# EAGLE design kegtroller_v1 (EAGLE 6.1)
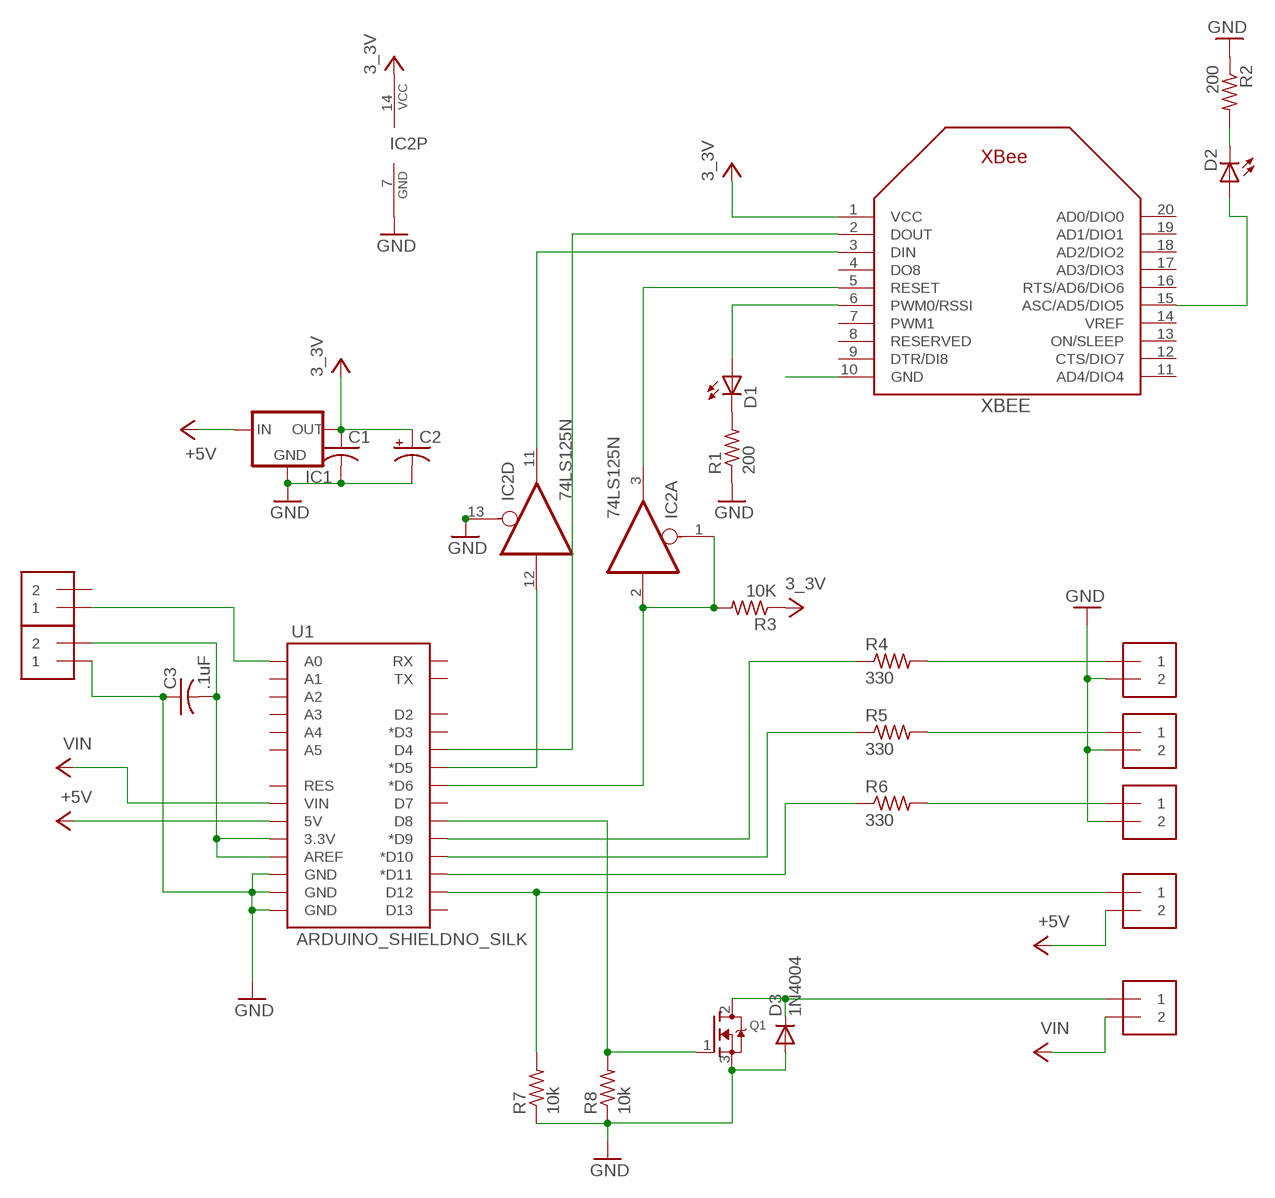
[diagram p0: schematic, sheet 1]

## Parts
C1  C-US025-025X050  [C025-025X050]
C2  CPOL-USE2.5-5  [E2,5-5]
C3  .1uF  C-US025-025X050  [C025-025X050]
D1  LED3MM  [LED3MM]
D2  LED3MM  [LED3MM]
D3  1N4004  [DO41-10]
IC1  MC1700  [TO92]
IC2  74LS125N  [DIL14]
J1  1X2-3.5MM  [1X2-3.5MM]
J2  1X2-3.5MM  [1X2-3.5MM]
J3  1X2-3.5MM  [1X2-3.5MM]
J4  1X2-3.5MM  [1X2-3.5MM]
J5  1X2-3.5MM  [1X2-3.5MM]
J6  1X2-3.5MM  [1X2-3.5MM]
J7  1X2-3.5MM  [1X2-3.5MM]
Q1  MOSFET-NGDS_TO220V  [TO220V]
R1  200  R-US_0207/10  [0207/10]
R2  200  R-US_0207/10  [0207/10]
R3  10K  R-US_0207/10  [0207/10]
R4  330  R-US_0204/5  [0204/5]
R5  330  R-US_0204/5  [0204/5]
R6  330  R-US_0204/5  [0204/5]
R7  10k  R-US_0204/5  [0204/5]
R8  10k  R-US_0204/5  [0204/5]
U1  ARDUINO_SHIELDNO_SILK  [DUEMILANOVE_VIAS]
XBEE  XBEE  [XBEE]

## Nets
3_3V: C1.1 C2.+ IC1.3(OUT) IC2.14(P:VCC) R3.1 XBEE.1(VCC)
+5V: IC1.2(IN) J4.2 U1.5V
GND: C1.2 C2.- C3.1 D3.A IC1.1(GND) IC2.7(P:GND) IC2.13(D:OE) J1.2 J2.2 J3.2 J6.1 Q1.3(S) R1.1 R2.1 R7.1 R8.1 U1.GND@0(GND) U1.GND@1(GND) U1.GND@2(GND) XBEE.10(GND)
N$1: IC2.12(D:I) U1.D5(*D5)
N$2: IC2.11(D:O) XBEE.3(DIN)
N$5: D2.K(C) R2.2
N$7: D1.A XBEE.6(PWM0/RSSI)
N$8: D1.K(C) R1.2
N$9: D2.A XBEE.15(ASC/AD5/DIO5)
N$13: IC2.3(A:O) XBEE.5(RESET)
N$22: R4.1 U1.D9(*D9)
N$23: R5.1 U1.D10(*D10)
N$24: R6.1 U1.D11(*D11)
N$25: J1.1 R4.2
N$26: J2.1 R5.2
N$27: J3.1 R6.2
N$29: C3.2 J6.2 U1.3.3V U1.AREF
N$30: J5.1 U1.A0
N$31: J4.1 R7.2 U1.D12
N$34: D3.C J7.1 Q1.2(D)
N$35: Q1.1(G) R8.2 U1.D8
RESET: IC2.1(A:OE) IC2.2(A:I) R3.2 U1.D6(*D6)
TX: U1.D4 XBEE.2(DOUT)
VIN: J7.2 U1.VIN
Unconnected: IC2.4(B:OE) IC2.5(B:I) IC2.6(B:O) IC2.8(C:O) IC2.9(C:I) IC2.10(C:OE) J5.2 U1.A1 U1.A2 U1.A3 U1.A4 U1.A5 U1.D2 U1.D3(*D3) U1.D7 U1.D13 U1.RES U1.RX U1.TX XBEE.4(DO8) XBEE.7(PWM1) XBEE.8(RESERVED) XBEE.9(DTR/DI8) XBEE.11(AD4/DIO4) XBEE.12(CTS/DIO7) XBEE.13(ON/SLEEP) XBEE.14(VREF) XBEE.16(RTS/AD6/DIO6) XBEE.17(AD3/DIO3) XBEE.18(AD2/DIO2) XBEE.19(AD1/DIO1) XBEE.20(AD0/DIO0)

## Library data of the parts
C1 = rcl-ez:C-US: CAPACITOR, American symbol
C2 = rcl-ez:CPOL-US: POLARIZED CAPACITOR, American symbol
C3 = adafruit:C-US: CAPACITOR, American symbol
D1 D2 = minimidi:LED: LED OSRAM: - CHIPLED LG R971, LG N971, LY N971, LG Q971, LY Q971, LO R971, LY R971 LH N974, LH R974 LS Q976, LO Q976, LY Q976 LO Q996 - Hyper CHIPLED LW Q18S LB Q993, LB Q99A, LB R99A - SideLED LS A670, LO A670, LY A670, LG A670, LP A670 LB A673, LV A673, LT A673, LW A673 LH A674 LY A675 LS A676, LA A676, LO A676, LY A676, LW A676 LS A679, LY A679, LG A679 - Hyper Micro SIDELED® LS Y876, LA Y876, LO Y876, LY Y876 LT Y87S - SmartLED LW L88C, LW L88S LB L89C, LB L89S, LG L890 LS L89K, LO L89K, LY L89K LS L896, LA L896, LO L896, LY L896 - TOPLED LS T670, LO T670, LY T670, LG T670, LP T670 LSG T670, LSP T670, LSY T670, LOP T670, LYG T670 LG T671, LOG T671, LSG T671 LB T673, LV T673, LT T673, LW T673 LH T674 LS T676, LA T676, LO T676, LY T676, LB T676, LH T676, LSB T676, LW T676 LB T67C, LV T67C, LT T67C, LS T67K, LO T67K, LY T67K, LW E67C LS E67B, LA E67B, LO E67B, LY E67B, LB E67C, LV E67C, LT E67C LW T67C LS T679, LY T679, LG T679 LS T770, LO T770, LY T770, LG T770, LP T770 LB T773, LV T773, LT T773, LW T773 LH T774 LS E675, LA E675, LY E675, LS T675 LS T776, LA T776, LO T776, LY T776, LB T776 LHGB T686 LT T68C, LB T68C - Hyper Mini TOPLED® LB M676 - Mini TOPLED Santana® LG M470 LS M47K, LO M47K, LY M47K Source: http://www.osram.convergy.de/
D3 = adafruit:1N4004: DIODE General purpose 1N400x type rectifier (With bigger pads) http://www.ladyada.net/library/pcb/eaglelibrary.html
IC1 = ulink:MC1700: VOLTAGE REGULATOR
IC2 = 74xx-us:74*125: Quad bus BUFFER, 3-state
J1-J7 = adafruit:1X2: 3.5mm Terminal block http://www.ladyada.net/library/pcb/eaglelibrary.html
Q1 = adafruit:MOSFET-N: N-Channel Mosfet 2N7002E - 60V 260mA SOT23 [Digikey: 2N7002ET1GOSTR-ND] - REEL BSH103 - 30V 850mA SOT23 [Digikey: 568-5013-1-ND]
R1-R3 = rcl-ez:R-US_: RESISTOR, American symbol
R4-R8 = adafruit:R-US_: RESISTOR, American symbol
U1 = SparkFun-Boards:ARDUINO_SHIELD: Arduino shield footprint
XBEE = ulink:XBEE

## Board
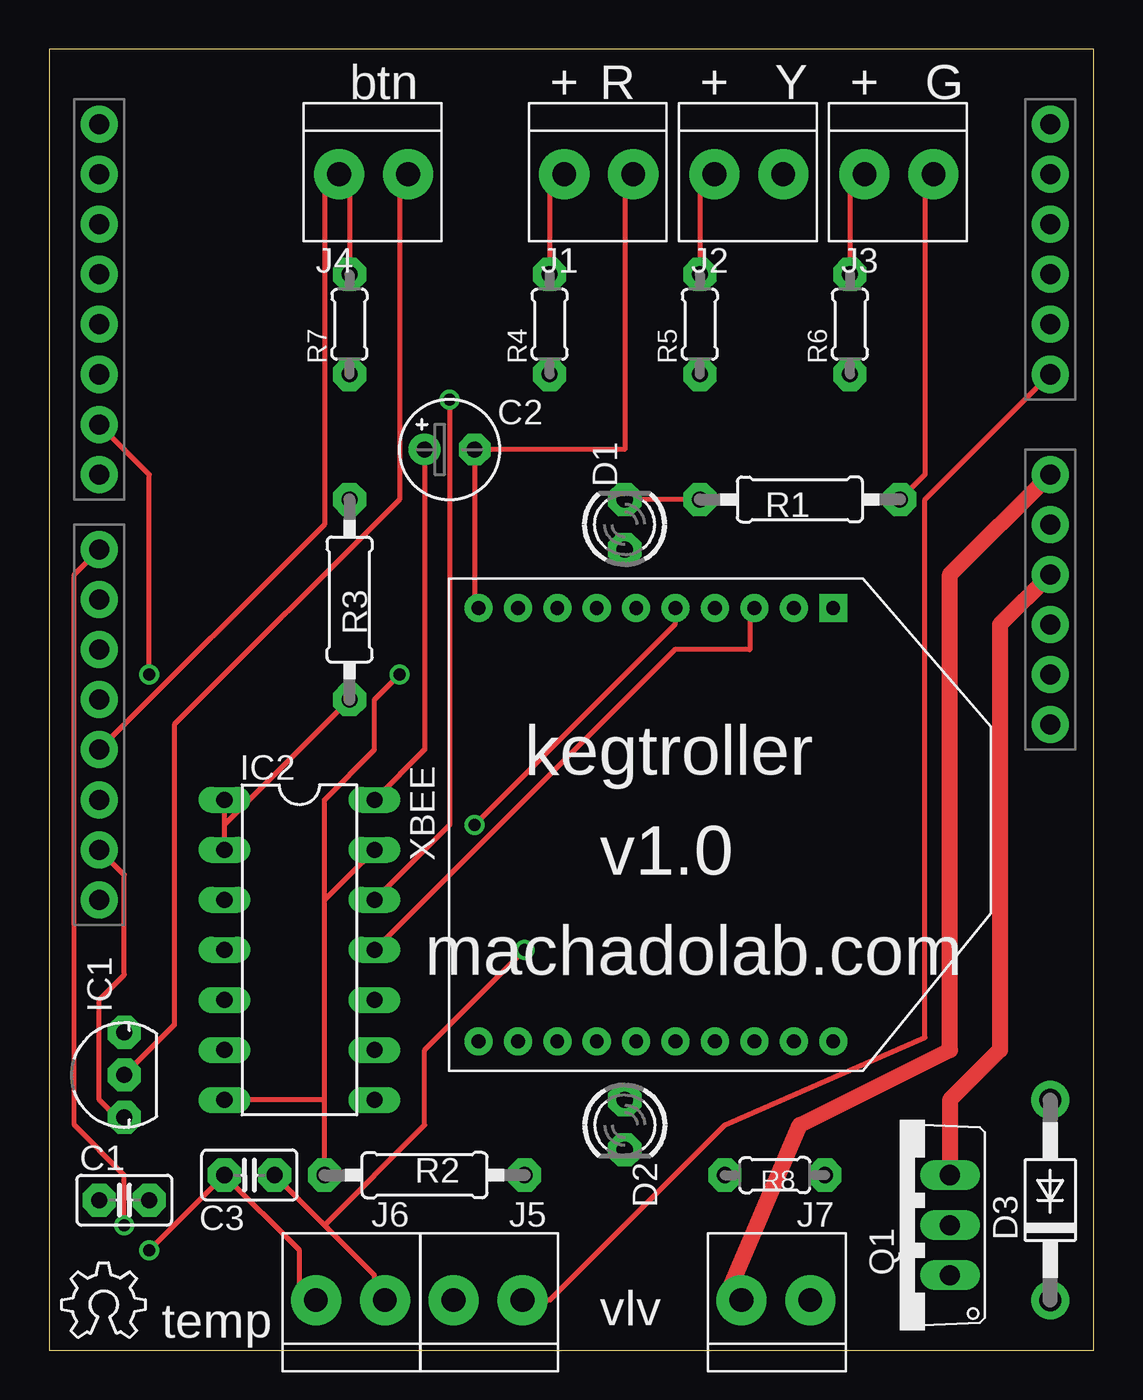
[diagram p1: board, top side]
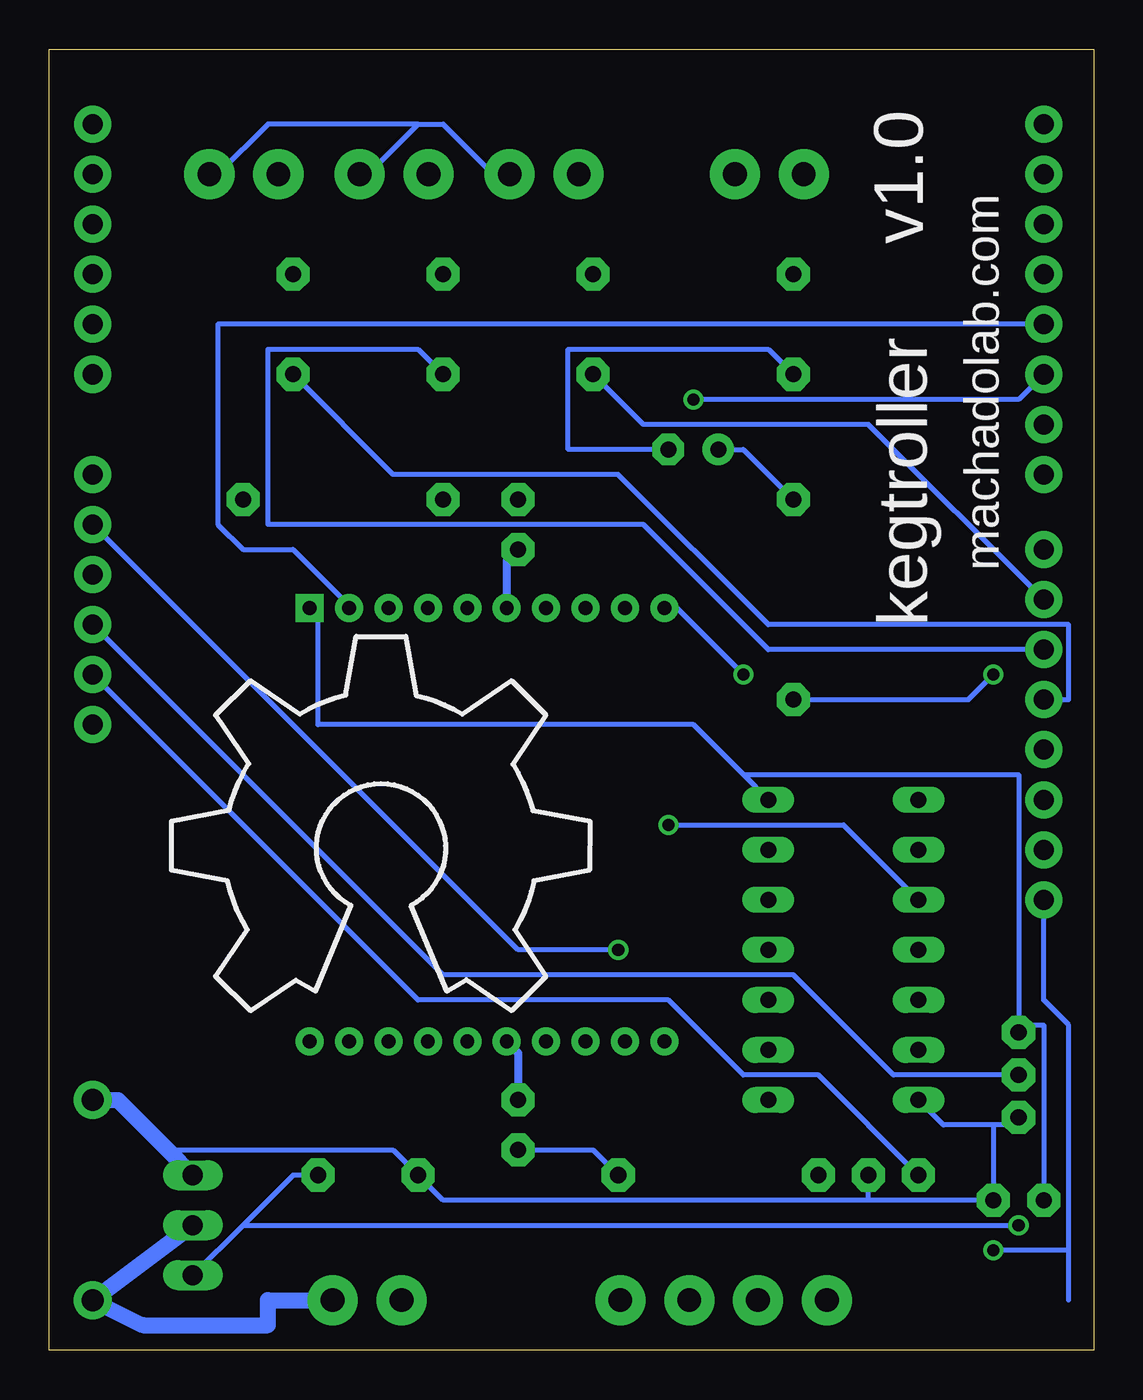
[diagram p2: board, bottom side, seen from below]

Size 53.01 x 66.03 mm. Coordinates in mm from the lower left corner, seen from the top.
Outline: 0,0 53.01,0 53.01,66.03 0,66.03 0,0
Copper layers (1*16): Top 0.035mm / dielectric 1.5mm / Bottom 0.035mm
Design rules: minimum track width 10mil, minimum drill 24mil, track to track 8mil, track to pad 8mil, pad to pad 8mil, via to via 8mil, smd to smd 8mil, copper to edge 40mil, drill to drill 8mil, minimum pad ring 10mil, minimum via ring 8mil, stop-mask expansion 4mil, vias tented up to drill 0mil, thermal gap 10mil

### Footprints (pad centres in the part's own frame; a part is rotated, then mirrored left to right if it is on the bottom)
C025-025X050 = drill 0.813 pad 1.676 octagon: 1 -1.27,0; 2 1.27,0
E2,5-5 = drill 0.813 pad 1.6: + -1.27,0 | drill 0.813 pad 1.6 octagon: - 1.27,0
LED3MM = drill 0.813 pad 1.676 octagon: A -1.27,0; K 1.27,0
DO41-10 = drill 1.118 pad 1.93: A 5.08,0; C -5.08,0
TO92 = drill 0.813 pad 1.676 octagon: 1 -2.159,0; 2 0,0; 3 2.159,0
DIL14 = drill 0.813 long: 1 -7.62,-3.81; 2 -5.08,-3.81; 3 -2.54,-3.81; 4 0,-3.81; 5 2.54,-3.81; 6 5.08,-3.81; 7 7.62,-3.81; 8 7.62,3.81; 9 5.08,3.81; 10 2.54,3.81; 11 0,3.81; 12 -2.54,3.81; 13 -5.08,3.81; 14 -7.62,3.81
1X2-3.5MM = drill 1.2 pad 2.54: 1 1.8,0; 2 -1.7,0
TO220V = drill 1.016 long: 1 -2.54,-2.54; 2 0,-2.54; 3 2.54,-2.54
0207/10 = drill 0.813 pad 1.676 octagon: 1 -5.08,0; 2 5.08,0
0204/5 = drill 0.813 pad 1.676 octagon: 1 -2.54,0; 2 2.54,0
DUEMILANOVE_VIAS = drill 1.016 pad 1.88: 3.3V 50.8,13.97; 5V 50.8,16.51; A0 50.8,29.21; A1 50.8,31.75; A2 50.8,34.29; A3 50.8,36.83; A4 50.8,39.37; A5 50.8,41.91; AREF 2.54,2.54; D2 2.54,36.83; D3 2.54,34.29; D4 2.54,31.75; D5 2.54,29.21; D6 2.54,26.67; D7 2.54,24.13; D8 2.54,20.32; D9 2.54,17.78; D10 2.54,15.24; D11 2.54,12.7; D12 2.54,10.16; D13 2.54,7.62; GND@0 50.8,19.05; GND@1 50.8,21.59; GND@2 2.54,5.08; RES 50.8,11.43; RX 2.54,41.91; TX 2.54,39.37; VIN 50.8,24.13
XBEE = drill 0.7 pad 1.422 square: 1 -11,5.5 | drill 0.7 pad 1.422: 2 -11,3.5; 3 -11,1.5; 4 -11,-0.5; 5 -11,-2.5; 6 -11,-4.5; 7 -11,-6.5; 8 -11,-8.5; 9 -11,-10.5; 10 -11,-12.5; 11 11,-12.5; 12 11,-10.5; 13 11,-8.5; 14 11,-6.5; 15 11,-4.5; 16 11,-2.5; 17 11,-0.5; 18 11,1.5; 19 11,3.5; 20 11,5.5

### Placement (x,y rotation side)
C1  3.81,7.62 0 top
C2  20.32,45.72 0 top
C3  10.16,8.89 180 top
D1  29.21,41.91 90 top
D2  29.21,11.43 270 top
D3  50.8,7.62 90 top
IC1  3.81,13.97 90 top
IC2  12.7,20.32 270 top
J1  27.94,59.69 180 top
J2  35.56,59.69 180 top
J3  43.18,59.69 180 top
J4  16.51,59.69 180 top
J5  22.23,2.54 0 top
J6  15.24,2.54 0 top
J7  36.83,2.54 0 top
Q1  43.18,6.35 90 top
R1  38.1,43.18 180 top
R2  19.05,8.89 0 top
R3  15.24,38.1 270 top
R4  25.4,52.07 90 top
R5  33.02,52.07 90 top
R6  40.64,52.07 90 top
R7  15.24,52.07 90 top
R8  36.83,8.89 0 top
U1  0,20.32 0 top
U$1  [OSHW_6X150_NOTEXT]  0.64,0.64 0 top
U$2  [OSHW_10X750_NOTEXT]  46.8,17.2 0 bottom
XBEE  34.29,26.67 270 top

### Tracks (layer width: path | path; a pad name or v marks a point on that pad's centre or on a via)
3_3V
  Top 0.254: IC2.14 19.05,30.48 C2.+
  Bottom 0.254: C1.1 2.54,16.51 3.81,16.51 | IC2.14 17.78,29.21 | 17.78,29.21 20.32,31.75 39.37,31.75 39.37,38.1 XBEE.1 | R3.1 17.78,45.72 C2.+ | 3.81,16.51 3.81,29.21 17.78,29.21 | 3.81,16.51 IC1.3
+5V
  Top 0.254: IC1.2 6.35,16.51 6.35,31.75 17.78,43.18 17.78,59.69 J4.2
  Bottom 0.254: U1.5V 33.02,19.05 15.24,19.05 10.16,13.97 IC1.2
GND  (via drill 0.61)
  Top 0.254: XBEE.10 21.59,38.1 C2.- 29.21,45.72 29.21,59.69 J1.2 | R1.1 44.45,44.45 44.45,59.69 J3.2 | 13.97,22.86 IC2.13 | R2.1 13.97,12.7 | 13.97,12.7 13.97,22.86 | 13.97,12.7 IC2.7 | v17.78,34.29 16.51,33.02 16.51,30.48 13.97,27.94 13.97,22.86 | 13.97,6.35 16.51,3.81 16.51,2.54 J6.1 | 13.97,6.35 C3.1 | v24.13,20.32 19.05,15.24 19.05,11.43 13.97,6.35 | U1.GND@2 3.81,24.13 3.81,19.05 2.54,17.78 2.54,12.7 3.81,11.43 IC1.1
  Top 0.813: U1.GND@0 48.26,36.83 48.26,15.24 45.72,12.7 Q1.3
  Bottom 0.254: R7.1 16.51,50.8 26.67,50.8 26.67,45.72 C2.- | 34.29,62.23 33.02,62.23 30.48,59.69 J1.2 | 34.29,62.23 36.83,59.69 J2.2 | 46.99,10.16 35.56,10.16 R8.1 33.02,7.62 11.43,7.62 | IC2.7 7.62,11.43 5.08,11.43 | 5.08,11.43 3.81,11.43 IC1.1 | 5.08,11.43 C1.2 11.43,7.62 | v17.78,34.29 21.59,38.1 XBEE.10 | U1.GND@1 29.21,20.32 v24.13,20.32 | 11.43,7.62 C3.1 | 34.29,62.23 41.91,62.23 44.45,59.69 J3.2
  Bottom 0.813: Q1.3 46.99,10.16 49.53,12.7 D3.A
N$1  (via drill 0.61)
  Top 0.254: IC2.12 20.32,26.67 v20.32,48.26
  Bottom 0.254: v20.32,48.26 3.81,48.26 U1.D5
N$2
  Top 0.254: IC2.11 31.75,35.56 35.56,35.56 35.56,38.1 XBEE.3
N$5
  Bottom 0.254: R2.2 25.4,10.16 D2.K
N$7
  Bottom 0.406: D1.A 29.79,40.06 XBEE.6
N$8
  Top 0.254: R1.2 D1.K
N$9
  Bottom 0.406: XBEE.15 29.21,15.09 D2.A
N$13  (via drill 0.61)
  Top 0.254: v21.59,26.67 31.75,36.83 31.75,38.1 XBEE.5
  Bottom 0.254: IC2.3 12.7,26.67 v21.59,26.67
N$22
  Bottom 0.254: R4.1 22.86,46.99 11.43,46.99 U1.D9
N$23
  Bottom 0.254: R5.1 34.29,50.8 41.91,50.8 41.91,41.91 22.86,41.91 16.51,35.56 U1.D10
N$24
  Bottom 0.254: R6.1 35.56,44.45 24.13,44.45 16.51,36.83 1.27,36.83 1.27,33.02 U1.D11
N$25
  Top 0.254: R4.2 25.4,59.69 J1.1
N$26
  Top 0.254: R5.2 33.02,59.69 J2.1
N$27
  Top 0.254: R6.2 40.64,59.69 J3.1
N$29  (via drill 0.61)
  Top 0.254: J6.2 12.7,2.54 12.7,5.08 C3.2 v5.08,5.08
  Bottom 0.254: U1.3.3V 34.29,17.78 21.59,17.78 17.78,13.97 13.97,13.97 C3.2 | U1.AREF 2.54,17.78 1.27,16.51 1.27,5.08 | 1.27,2.54 1.27,5.08 | 1.27,5.08 v5.08,5.08
N$30
  Top 0.254: U1.A0 44.45,43.18 44.45,15.88 34.29,11.43 25.4,2.54 J5.1
N$31
  Top 0.254: R7.2 15.24,59.69 J4.1 13.97,59.69 13.97,41.91 U1.D12
N$34
  Bottom 0.813: Q1.2 D3.C 48.26,1.27 41.91,1.27 41.91,2.54 J7.1
N$35  (via drill 0.61)
  Top 0.254: U1.D8 1.27,39.37 1.27,11.43 3.81,8.89 v3.81,6.35
  Bottom 0.254: 43.18,6.35 40.64,8.89 R8.2 | 43.18,6.35 Q1.1 | 43.18,6.35 v3.81,6.35
RESET  (via drill 0.61)
  Top 0.254: IC2.1 8.89,26.67 | 8.89,26.67 IC2.2 | 8.89,26.67 R3.2 | U1.D6 5.08,44.45 v5.08,34.29
  Bottom 0.254: v5.08,34.29 6.35,33.02 R3.2
TX
  Bottom 0.254: U1.D4 44.45,52.07 44.45,41.91 43.18,40.64 40.64,40.64 38.1,38.1 XBEE.2
VIN
  Top 0.813: U1.VIN 45.72,39.37 45.72,15.24 38.1,11.43 34.29,2.54 J7.2

### Text on the board
bPlace: v1.0 | machadolab.com | kegtroller
tNames: btn | + | R | + | Y | + | G | kegtroller | v1.0 | machadolab.com | temp | vlv